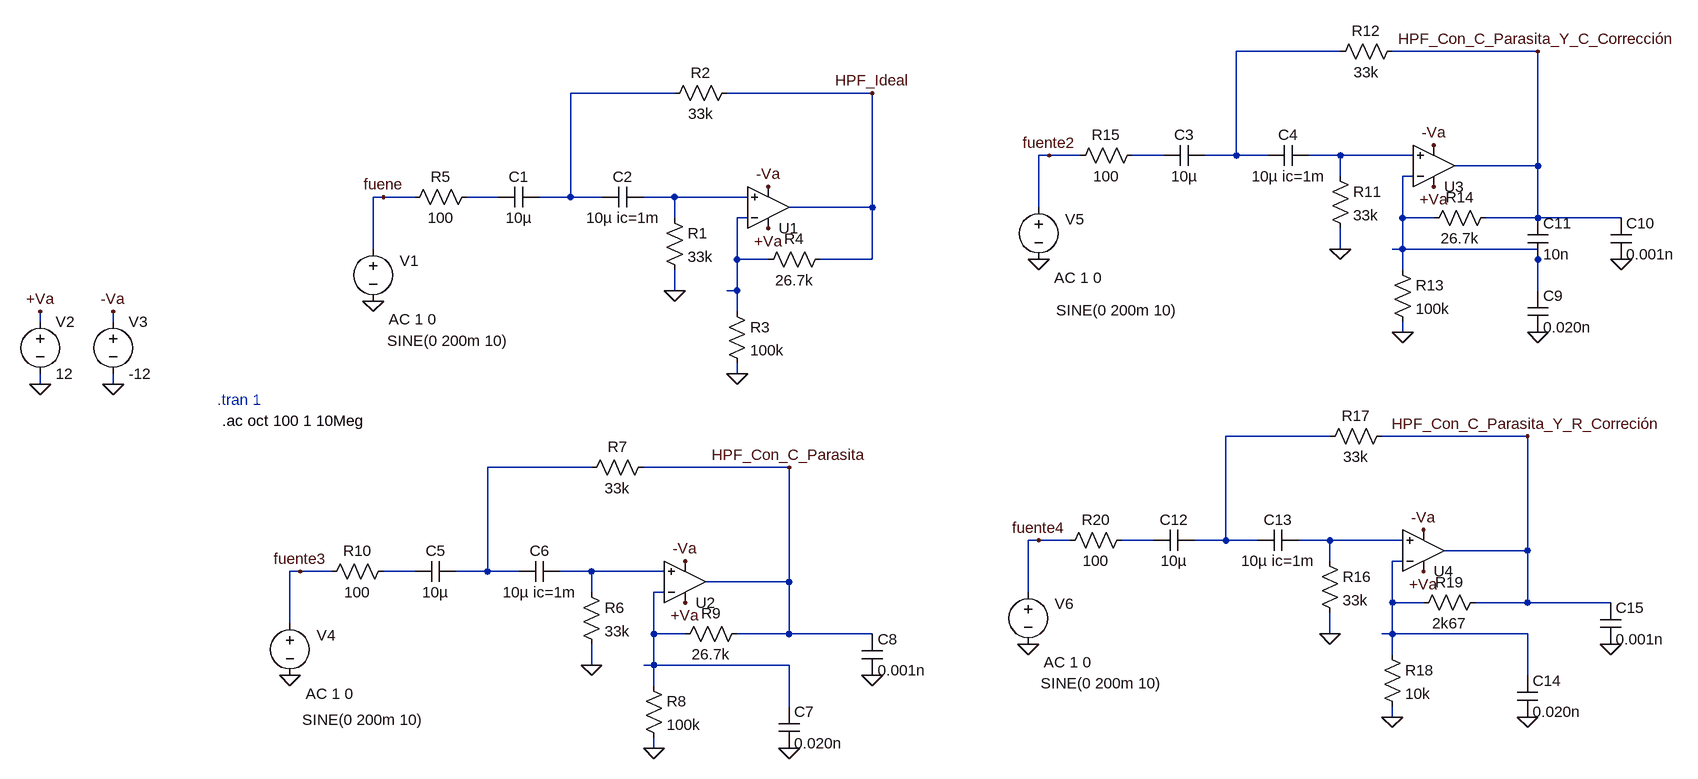
[diagram p0: schematic Prueba_Correcciones_HPF.asc]
Prueba_Correcciones_HPF.asc, the LTspice schematic file:
Version 4
SHEET 1 1788 964
WIRE 1184 -128 1024 -128
WIRE 1488 -128 1264 -128
WIRE 160 -64 0 -64
WIRE 464 -64 240 -64
WIRE 736 32 720 32
WIRE 784 32 736 32
WIRE 912 32 864 32
WIRE 1024 32 1024 -128
WIRE 1024 32 976 32
WIRE 1072 32 1024 32
WIRE 1184 32 1136 32
WIRE 1296 32 1184 32
WIRE 1488 48 1488 -128
WIRE 1488 48 1360 48
WIRE 1184 64 1184 32
WIRE 1296 64 1280 64
WIRE -288 96 -304 96
WIRE -240 96 -288 96
WIRE -112 96 -160 96
WIRE 0 96 0 -64
WIRE 0 96 -48 96
WIRE 48 96 0 96
WIRE 160 96 112 96
WIRE 272 96 160 96
WIRE 464 112 464 -64
WIRE 464 112 336 112
WIRE 720 112 720 32
WIRE 160 128 160 96
WIRE 272 128 256 128
WIRE 1280 128 1280 64
WIRE 1328 128 1280 128
WIRE 1488 128 1488 48
WIRE 1488 128 1408 128
WIRE 1616 128 1488 128
WIRE -304 176 -304 96
WIRE 1184 176 1184 144
WIRE 1280 176 1280 128
WIRE 1280 176 1264 176
WIRE 1488 176 1280 176
WIRE 256 192 256 128
WIRE 304 192 256 192
WIRE 464 192 464 112
WIRE 464 192 384 192
WIRE 1488 192 1488 176
WIRE 1280 208 1280 176
WIRE 160 240 160 208
WIRE 256 240 256 192
WIRE 256 240 240 240
WIRE 1488 240 1488 192
WIRE 256 272 256 240
WIRE -816 288 -816 272
WIRE -704 288 -704 272
WIRE 1280 304 1280 288
WIRE 256 368 256 352
WIRE -816 384 -816 368
WIRE -704 384 -704 368
WIRE 1168 464 1008 464
WIRE 1472 464 1248 464
WIRE 32 512 -128 512
WIRE 336 512 112 512
WIRE 720 624 704 624
WIRE 768 624 720 624
WIRE 896 624 848 624
WIRE 1008 624 1008 464
WIRE 1008 624 960 624
WIRE 1056 624 1008 624
WIRE 1168 624 1120 624
WIRE 1280 624 1168 624
WIRE 1472 640 1472 464
WIRE 1472 640 1344 640
WIRE 1168 656 1168 624
WIRE 1280 656 1264 656
WIRE -416 672 -432 672
WIRE -368 672 -416 672
WIRE -240 672 -288 672
WIRE -128 672 -128 512
WIRE -128 672 -176 672
WIRE -80 672 -128 672
WIRE 32 672 -16 672
WIRE 144 672 32 672
WIRE 336 688 336 512
WIRE 336 688 208 688
WIRE 32 704 32 672
WIRE 144 704 128 704
WIRE 704 704 704 624
WIRE 1264 720 1264 656
WIRE 1312 720 1264 720
WIRE 1472 720 1472 640
WIRE 1472 720 1392 720
WIRE 1600 720 1472 720
WIRE -432 752 -432 672
WIRE 128 768 128 704
WIRE 176 768 128 768
WIRE 336 768 336 688
WIRE 336 768 256 768
WIRE 464 768 336 768
WIRE 1168 768 1168 736
WIRE 1264 768 1264 720
WIRE 1264 768 1248 768
WIRE 1472 768 1264 768
WIRE 1264 800 1264 768
WIRE 32 816 32 784
WIRE 128 816 128 768
WIRE 128 816 112 816
WIRE 336 816 128 816
WIRE 1472 832 1472 768
WIRE 128 848 128 816
WIRE 336 880 336 816
WIRE 1264 896 1264 880
WIRE 128 944 128 928
FLAG 160 240 0
FLAG 304 144 +Va
FLAG 304 80 -Va
FLAG 464 -64 HPF_Ideal
FLAG 256 368 0
FLAG -304 256 0
FLAG -288 96 fuene
FLAG -816 272 +Va
FLAG -816 384 0
FLAG -704 272 -Va
FLAG -704 384 0
FLAG 32 816 0
FLAG 176 720 +Va
FLAG 176 656 -Va
FLAG 336 512 HPF_Con_C_Parasita
FLAG 128 944 0
FLAG -432 832 0
FLAG -416 672 fuente3
FLAG 336 944 0
FLAG 464 832 0
FLAG 1184 176 0
FLAG 1328 80 +Va
FLAG 1328 16 -Va
FLAG 1488 -128 HPF_Con_C_Parasita_Y_C_Corrección
FLAG 1280 304 0
FLAG 720 192 0
FLAG 736 32 fuente2
FLAG 1488 304 0
FLAG 1616 192 0
FLAG 1168 768 0
FLAG 1312 672 +Va
FLAG 1312 608 -Va
FLAG 1472 464 HPF_Con_C_Parasita_Y_R_Correción
FLAG 1264 896 0
FLAG 704 784 0
FLAG 720 624 fuente4
FLAG 1472 896 0
FLAG 1600 784 0
SYMBOL cap -48 80 R90
WINDOW 0 0 32 VBottom 2
WINDOW 3 32 32 VTop 2
SYMATTR InstName C1
SYMATTR Value 10µ
SYMBOL cap 112 80 R90
WINDOW 0 0 32 VBottom 2
WINDOW 3 32 32 VTop 2
SYMATTR InstName C2
SYMATTR Value 10µ ic=1m
SYMBOL res 144 112 R0
SYMATTR InstName R1
SYMATTR Value 33k
SYMBOL res 256 -80 R90
WINDOW 0 0 56 VBottom 2
WINDOW 3 32 56 VTop 2
SYMATTR InstName R2
SYMATTR Value 33k
SYMBOL OpAmps\\UniversalOpAmp2 304 112 M180
SYMATTR InstName U1
SYMBOL res 240 256 R0
SYMATTR InstName R3
SYMATTR Value 100k
SYMBOL res 400 176 R90
WINDOW 0 0 56 VBottom 2
WINDOW 3 32 56 VTop 2
SYMATTR InstName R4
SYMATTR Value 26.7k
SYMBOL voltage -304 160 R0
WINDOW 0 41 34 Left 2
WINDOW 123 24 124 Left 2
WINDOW 39 0 0 Left 0
WINDOW 3 22 157 Left 2
SYMATTR InstName V1
SYMATTR Value2 AC 1 0
SYMATTR Value SINE(0 200m 10)
SYMBOL res -144 80 R90
WINDOW 0 0 56 VBottom 2
WINDOW 3 32 56 VTop 2
SYMATTR InstName R5
SYMATTR Value 100
SYMBOL voltage -816 272 R0
WINDOW 123 0 0 Left 2
WINDOW 39 0 0 Left 2
SYMATTR InstName V2
SYMATTR Value 12
SYMBOL voltage -704 272 R0
WINDOW 123 24 146 Left 2
WINDOW 39 24 125 Left 2
SYMATTR InstName V3
SYMATTR Value -12
SYMBOL cap -176 656 R90
WINDOW 0 0 32 VBottom 2
WINDOW 3 32 32 VTop 2
SYMATTR InstName C5
SYMATTR Value 10µ
SYMBOL cap -16 656 R90
WINDOW 0 0 32 VBottom 2
WINDOW 3 32 32 VTop 2
SYMATTR InstName C6
SYMATTR Value 10µ ic=1m
SYMBOL res 16 688 R0
SYMATTR InstName R6
SYMATTR Value 33k
SYMBOL res 128 496 R90
WINDOW 0 0 56 VBottom 2
WINDOW 3 32 56 VTop 2
SYMATTR InstName R7
SYMATTR Value 33k
SYMBOL OpAmps\\UniversalOpAmp2 176 688 M180
SYMATTR InstName U2
SYMBOL res 112 832 R0
SYMATTR InstName R8
SYMATTR Value 100k
SYMBOL res 272 752 R90
WINDOW 0 0 56 VBottom 2
WINDOW 3 32 56 VTop 2
SYMATTR InstName R9
SYMATTR Value 26.7k
SYMBOL voltage -432 736 R0
WINDOW 0 41 34 Left 2
WINDOW 123 24 124 Left 2
WINDOW 39 0 0 Left 0
WINDOW 3 19 164 Left 2
SYMATTR InstName V4
SYMATTR Value2 AC 1 0
SYMATTR Value SINE(0 200m 10)
SYMBOL res -272 656 R90
WINDOW 0 0 56 VBottom 2
WINDOW 3 32 56 VTop 2
SYMATTR InstName R10
SYMATTR Value 100
SYMBOL cap 320 880 R0
SYMATTR InstName C7
SYMATTR Value 0.020n
SYMBOL cap 448 768 R0
SYMATTR InstName C8
SYMATTR Value 0.001n
SYMBOL cap 976 16 R90
WINDOW 0 0 32 VBottom 2
WINDOW 3 32 32 VTop 2
SYMATTR InstName C3
SYMATTR Value 10µ
SYMBOL cap 1136 16 R90
WINDOW 0 0 32 VBottom 2
WINDOW 3 32 32 VTop 2
SYMATTR InstName C4
SYMATTR Value 10µ ic=1m
SYMBOL res 1168 48 R0
SYMATTR InstName R11
SYMATTR Value 33k
SYMBOL res 1280 -144 R90
WINDOW 0 0 56 VBottom 2
WINDOW 3 32 56 VTop 2
SYMATTR InstName R12
SYMATTR Value 33k
SYMBOL OpAmps\\UniversalOpAmp2 1328 48 M180
SYMATTR InstName U3
SYMBOL res 1264 192 R0
SYMATTR InstName R13
SYMATTR Value 100k
SYMBOL res 1424 112 R90
WINDOW 0 0 56 VBottom 2
WINDOW 3 32 56 VTop 2
SYMATTR InstName R14
SYMATTR Value 26.7k
SYMBOL voltage 720 96 R0
WINDOW 0 41 34 Left 2
WINDOW 123 24 124 Left 2
WINDOW 39 0 0 Left 0
WINDOW 3 27 174 Left 2
SYMATTR InstName V5
SYMATTR Value2 AC 1 0
SYMATTR Value SINE(0 200m 10)
SYMBOL res 880 16 R90
WINDOW 0 0 56 VBottom 2
WINDOW 3 32 56 VTop 2
SYMATTR InstName R15
SYMATTR Value 100
SYMBOL cap 1472 240 R0
SYMATTR InstName C9
SYMATTR Value 0.020n
SYMBOL cap 1600 128 R0
SYMATTR InstName C10
SYMATTR Value 0.001n
SYMBOL cap 1472 128 R0
SYMATTR InstName C11
SYMATTR Value 10n
SYMBOL cap 960 608 R90
WINDOW 0 0 32 VBottom 2
WINDOW 3 32 32 VTop 2
SYMATTR InstName C12
SYMATTR Value 10µ
SYMBOL cap 1120 608 R90
WINDOW 0 0 32 VBottom 2
WINDOW 3 32 32 VTop 2
SYMATTR InstName C13
SYMATTR Value 10µ ic=1m
SYMBOL res 1152 640 R0
SYMATTR InstName R16
SYMATTR Value 33k
SYMBOL res 1264 448 R90
WINDOW 0 0 56 VBottom 2
WINDOW 3 32 56 VTop 2
SYMATTR InstName R17
SYMATTR Value 33k
SYMBOL OpAmps\\UniversalOpAmp2 1312 640 M180
SYMATTR InstName U4
SYMBOL res 1248 784 R0
SYMATTR InstName R18
SYMATTR Value 10k
SYMBOL res 1408 704 R90
WINDOW 0 0 56 VBottom 2
WINDOW 3 32 56 VTop 2
SYMATTR InstName R19
SYMATTR Value 2k67
SYMBOL voltage 704 688 R0
WINDOW 0 41 34 Left 2
WINDOW 123 24 124 Left 2
WINDOW 39 0 0 Left 0
WINDOW 3 19 156 Left 2
SYMATTR InstName V6
SYMATTR Value2 AC 1 0
SYMATTR Value SINE(0 200m 10)
SYMBOL res 864 608 R90
WINDOW 0 0 56 VBottom 2
WINDOW 3 32 56 VTop 2
SYMATTR InstName R20
SYMATTR Value 100
SYMBOL cap 1456 832 R0
SYMATTR InstName C14
SYMATTR Value 0.020n
SYMBOL cap 1584 720 R0
SYMATTR InstName C15
SYMATTR Value 0.001n
TEXT -544 408 Left 2 ;.tran 1
TEXT -536 440 Left 2 !.ac oct 100 1 10Meg

The netlist it stands for:
* Prueba_Correcciones_HPF.asc
C1 N002 N006 10µ
C2 N007 N002 10µ ic=1m
R1 N007 0 33k
R2 HPF_Ideal N002 33k
XU1 N007 N008 +Va -Va HPF_Ideal level2 Avol=1Meg GBW=10Meg Slew=10Meg Ilimit=25m Rail=0 Vos=0 En=0 Enk=0 In=0 Ink=0 Rin=500Meg  ; pins In+ In- V+ V- OUT
R3 N008 0 100k
R4 HPF_Ideal N008 26.7k
V1 fuene 0 SINE(0 200m 10) AC 1 0
R5 N006 fuene 100
V2 +Va 0 12
V3 -Va 0 -12
C5 N010 N014 10µ
C6 N015 N010 10µ ic=1m
R6 N015 0 33k
R7 HPF_Con_C_Parasita N010 33k
XU2 N015 N016 +Va -Va HPF_Con_C_Parasita level2 Avol=1Meg GBW=10Meg Slew=10Meg Ilimit=25m Rail=0 Vos=0 En=0 Enk=0 In=0 Ink=0 Rin=500Meg  ; pins In+ In- V+ V- OUT
R8 N016 0 100k
R9 HPF_Con_C_Parasita N016 26.7k
V4 fuente3 0 SINE(0 200m 10) AC 1 0
R10 N014 fuente3 100
C7 N016 0 0.020n
C8 HPF_Con_C_Parasita 0 0.001n
C3 N001 N003 10µ
C4 N004 N001 10µ ic=1m
R11 N004 0 33k
R12 HPF_Con_C_Parasita_Y_C_Corrección N001 33k
XU3 N004 N005 +Va -Va HPF_Con_C_Parasita_Y_C_Corrección level2 Avol=1Meg GBW=10Meg Slew=10Meg Ilimit=25m Rail=0 Vos=0 En=0 Enk=0 In=0 Ink=0 Rin=500Meg  ; pins In+ In- V+ V- OUT
R13 N005 0 100k
R14 HPF_Con_C_Parasita_Y_C_Corrección N005 26.7k
V5 fuente2 0 SINE(0 200m 10) AC 1 0
R15 N003 fuente2 100
C9 N005 0 0.020n
C10 HPF_Con_C_Parasita_Y_C_Corrección 0 0.001n
C11 HPF_Con_C_Parasita_Y_C_Corrección N005 10n
C12 N009 N011 10µ
C13 N012 N009 10µ ic=1m
R16 N012 0 33k
R17 HPF_Con_C_Parasita_Y_R_Correción N009 33k
XU4 N012 N013 +Va -Va HPF_Con_C_Parasita_Y_R_Correción level2 Avol=1Meg GBW=10Meg Slew=10Meg Ilimit=25m Rail=0 Vos=0 En=0 Enk=0 In=0 Ink=0 Rin=500Meg  ; pins In+ In- V+ V- OUT
R18 N013 0 10k
R19 HPF_Con_C_Parasita_Y_R_Correción N013 2k67
V6 fuente4 0 SINE(0 200m 10) AC 1 0
R20 N011 fuente4 100
C14 N013 0 0.020n
C15 HPF_Con_C_Parasita_Y_R_Correción 0 0.001n
* .tran 1
.ac oct 100 1 10Meg
.lib UniversalOpAmp2.lib
.backanno
.end